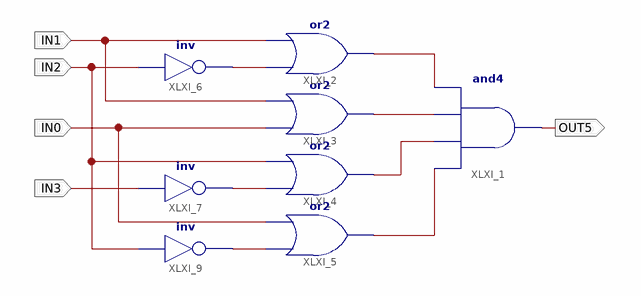
[diagram p0: schematic sheet 1]
// Xilinx ISE schematic Segmento5.sch (spartan3e) as structural Verilog: 8 symbols, 5 ports
module Segmento5 (
  input  IN1,
  input  IN2,
  input  IN0,
  input  IN3,
  output OUT5
);

  wire XLXN_1, XLXN_2, XLXN_3, XLXN_4, XLXN_18, XLXN_19, XLXN_20;

  and XLXI_1 (OUT5, XLXN_4, XLXN_3, XLXN_2, XLXN_1);
  or XLXI_2 (XLXN_1, XLXN_18, IN1);
  or XLXI_3 (XLXN_2, IN0, IN1);
  or XLXI_4 (XLXN_3, XLXN_19, IN2);
  or XLXI_5 (XLXN_4, XLXN_20, IN0);
  not XLXI_6 (XLXN_18, IN2);
  not XLXI_7 (XLXN_19, IN3);
  not XLXI_9 (XLXN_20, IN2);
endmodule
